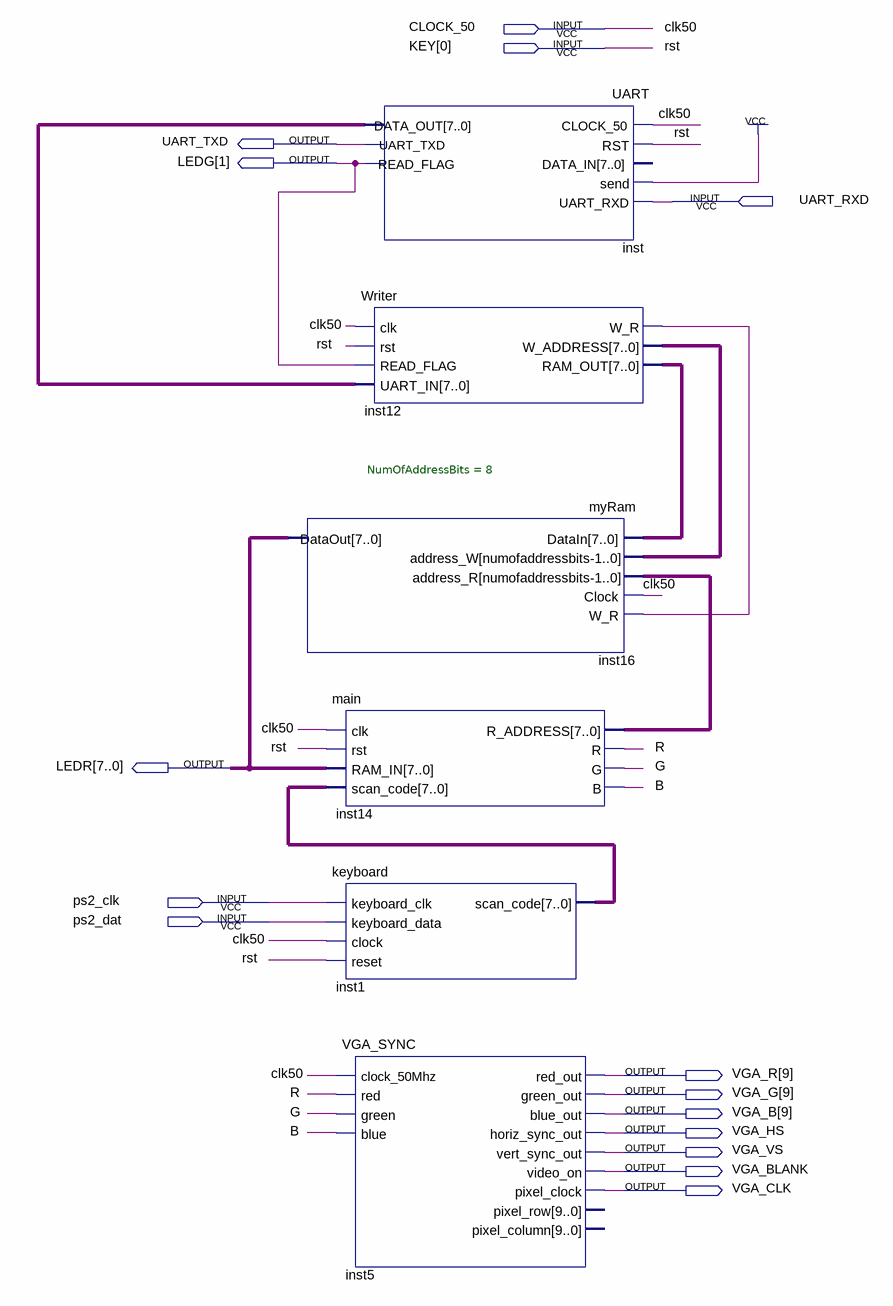
[diagram p0: schematic sheet]
// Quartus schematic ALL.bdf as structural Verilog: 6 symbols, 15 pins
module ALL (
  input  CLOCK_50,
  input  [0:0] KEY,
  input  UART_RXD,
  input  ps2_clk,
  input  ps2_dat,
  output UART_TXD,
  output [1:1] LEDG,
  output [7:0] LEDR,
  output [9:9] VGA_R,
  output [9:9] VGA_G,
  output [9:9] VGA_B,
  output VGA_HS,
  output VGA_VS,
  output VGA_BLANK,
  output VGA_CLK
);

  wire B, G, inst12_w_r, R;
  wire [7:0] inst1_scan_code, inst12_ram_out, inst12_w_address, inst14_r_address, inst_data_out;

  myRam #(.NumOfAddressBits(8)) inst16 (
    .DataIn(inst12_ram_out), .address_W(inst12_w_address), .address_R(inst14_r_address), .Clock(CLOCK_50),
    .W_R(inst12_w_r), .DataOut(LEDR));
  UART inst (
    .CLOCK_50(CLOCK_50), .RST(KEY[0]), .send(1'b1), .UART_RXD(UART_RXD), .DATA_OUT(inst_data_out),
    .UART_TXD(UART_TXD), .READ_FLAG(LEDG[1]));  // open: DATA_IN
  Writer inst12 (
    .clk(CLOCK_50), .rst(KEY[0]), .READ_FLAG(LEDG[1]), .UART_IN(inst_data_out), .W_R(inst12_w_r),
    .W_ADDRESS(inst12_w_address), .RAM_OUT(inst12_ram_out));
  main inst14 (
    .clk(CLOCK_50), .rst(KEY[0]), .RAM_IN(LEDR), .scan_code(inst1_scan_code), .R_ADDRESS(inst14_r_address),
    .R(R), .G(G), .B(B));
  keyboard inst1 (
    .keyboard_clk(ps2_clk), .keyboard_data(ps2_dat), .clock(CLOCK_50), .reset(KEY[0]),
    .scan_code(inst1_scan_code));
  VGA_SYNC inst5 (
    .clock_50Mhz(CLOCK_50), .red(R), .green(G), .blue(B), .red_out(VGA_R[9]), .green_out(VGA_G[9]),
    .blue_out(VGA_B[9]), .horiz_sync_out(VGA_HS), .vert_sync_out(VGA_VS), .video_on(VGA_BLANK),
    .pixel_clock(VGA_CLK));  // open: pixel_row, pixel_column

  // Other names for the same wires on the sheet: clk50 = CLOCK_50; rst = KEY[0]
endmodule
